# Altium project XMS0004.PrjPcb (part 3 of 3)

## Sheet Clocks.SchDoc: xcore.ai Multi Channel Audio
size 408 x 287 mm; DocumentNumber: 6; Revision: 1V1; SheetNumber: 6; SheetTotal: 8
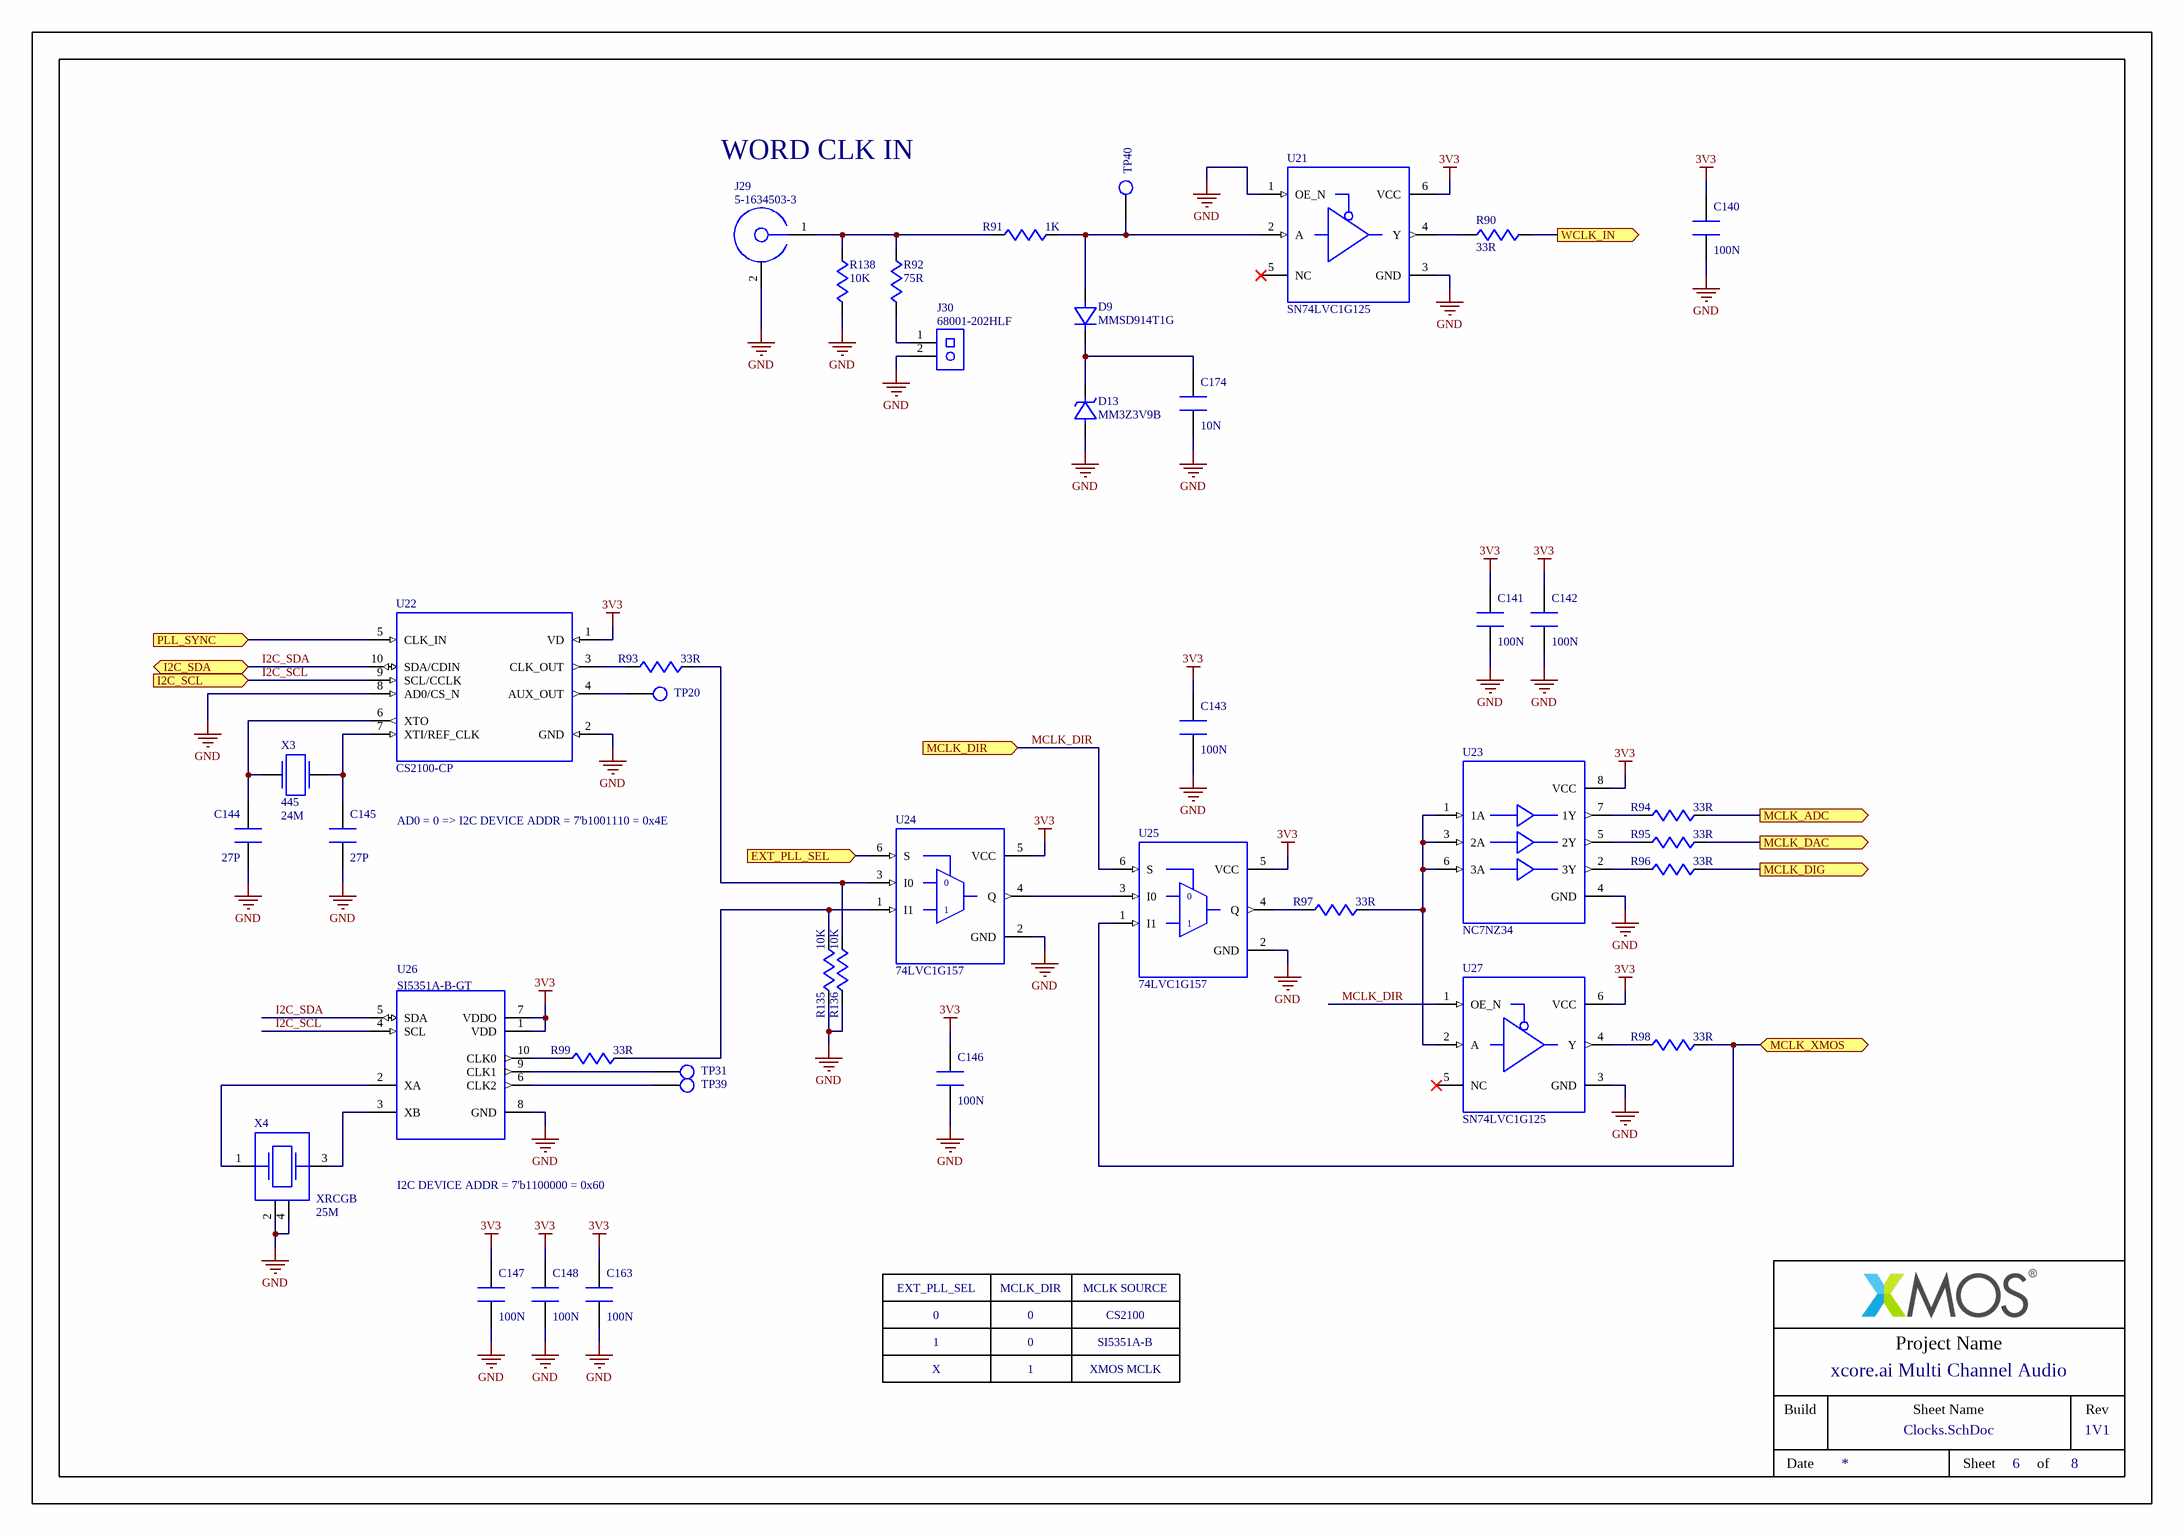
[diagram p9: Clocks.SchDoc]

### Parts
C140  100N  [CAPC1005X55N]
C141  100N  [CAPC1005X55N]
C142  100N  [CAPC1005X55N]
C143  100N  [CAPC1005X55N]
C144  27P  [CAPC1005X55N]
C145  27P  [CAPC1005X55N]
C146  100N  [CAPC1005X55N]
C147  100N  [CAPC1005X55N]
C148  100N  [CAPC1005X55N]
C163  100N  [CAPC1005X55N]
C174  10N  [CAPC1005X55N]
D9  MMSD914T1G  [SOD3716X135N]
D13  MM3Z3V9B  [SODFL2513X100N]
J29  5-1634503-3  [CON_TE_5_1634503]
J30  68001-202HLF  [HDR_FCI_68001_202]
R90  33R  [RESC1608X55N]
R91  1K  [RESC1608X55N]
R92  75R  [RESC3116X65N]
R93  33R  [RESC1608X55N]
R94  33R  [RESC1608X55N]
R95  33R  [RESC1608X55N]
R96  33R  [RESC1608X55N]
R97  33R  [RESC1608X55N]
R98  33R  [RESC1608X55N]
R99  33R  [RESC1608X55N]
R135  10K  [RESC1608X55N]
R136  10K  [RESC1608X55N]
R138  10K  [RESC1608X55N]
TP20  TESTPOINT  [TESTPOINT_THRU]  (value not drawn)  (no BOM)
TP31  TESTPOINT  [TESTPOINT_THRU]  (value not drawn)  (no BOM)
TP39  TESTPOINT  [TESTPOINT_THRU]  (value not drawn)  (no BOM)
TP40  TESTPOINT  [TESTPOINT_SMD_1MM]  (value not drawn)  (no BOM)
U21  SN74LVC1G125  [TI_R_PUSON_N6]
U22  CS2100-CP  [SOP50P490X110-10N]
U23  NC7NZ34  [SOP50P310X100-8N]
U24  74LVC1G157  [SOT95P280X145-6N]
U25  74LVC1G157  [SOT95P280X145-6N]
U26  SI5351A-B-GT  [SOP50P490X110-10N]
U27  SN74LVC1G125  [TI_R_PUSON_N6]
X3  445  FREQUENCY: 24M  [XTAL_CTS_445]
X4  XRCGB  FREQUENCY: 25M  [OSCCC200X160X70N]

### Ports
EXT_PLL_SEL (in), I2C_SCL (in), I2C_SDA (bidir), MCLK_ADC (out), MCLK_DAC (out), MCLK_DIG (out), MCLK_DIR (in), MCLK_XMOS (bidir), PLL_SYNC (in), WCLK_IN (out)

### Nets
3V3: C140.1 C141.1 C142.1 C143.1 C146.1 C147.1 C148.1 C163.1 U21.6(VCC) U22.1(VD) U23.8(VCC) U24.5(VCC) U25.5(VCC) U26.1(VDD) U26.7(VDDO) U27.6(VCC)
GND: C140.2 C141.2 C142.2 C143.2 C144.2 C145.2 C146.2 C147.2 C148.2 C163.2 C174.2 D13.2(A) J29.2 J30.2 R135.1 R136.1 R138.1 U21.1(OE_N) U21.3(GND) U22.2(GND) U22.8(AD0/CS_N) U23.4(GND) U24.2(GND) U25.2(GND) U26.8(GND) U27.3(GND) X4.2(CASE_2) X4.4(CASE_4)
EXT_PLL_SEL: U24.6(S) ; port EXT_PLL_SEL
I2C_SCL: U22.9(SCL/CCLK) U26.4(SCL) ; port I2C_SCL  [project net I2C1_SCL]
I2C_SDA: U22.10(SDA/CDIN) U26.5(SDA) ; port I2C_SDA  [project net I2C1_SDA]
MCLK_ADC: R94.2 ; port MCLK_ADC
MCLK_DAC: R95.2 ; port MCLK_DAC
MCLK_DIG: R96.2 ; port MCLK_DIG
MCLK_DIR: U25.6(S) U27.1(OE_N) ; port MCLK_DIR
MCLK_XMOS: R98.2 U25.1(I1) ; port MCLK_XMOS
PLL_SYNC: U22.5(CLK_IN) ; port PLL_SYNC
WCLK_IN: R90.2 ; port WCLK_IN
NetC144_1: C144.1 U22.6(XTO) X3.1(A)
NetC145_1: C145.1 U22.7(XTI/REF_CLK) X3.2(B)
NetC174_1: C174.1 D9.1(K) D13.1(K)
NetD9_2: D9.2(A) R91.2 TP40.1 U21.2(A)
NetJ29_1: J29.1 R91.1 R92.2 R138.2
NetJ30_1: J30.1 R92.1
NetR90_1: R90.1 U21.4(Y)
NetR93_1: R93.1 U22.3(CLK_OUT)
NetR93_2: R93.2 R136.2 U24.3(I0)
NetR94_1: R94.1 U23.7(1Y)
NetR95_1: R95.1 U23.5(2Y)
NetR96_1: R96.1 U23.2(3Y)
NetR97_1: R97.1 U25.4(Q)
NetR97_2: R97.2 U23.1(1A) U23.3(2A) U23.6(3A) U27.2(A)
NetR98_1: R98.1 U27.4(Y)
NetR99_1: R99.1 U26.10(CLK0)
NetR99_2: R99.2 R135.2 U24.1(I1)
NetTP20_1: TP20.1 U22.4(AUX_OUT)
NetTP31_1: TP31.1 U26.9(CLK1)
NetTP39_1: TP39.1 U26.6(CLK2)
NetU24_4: U24.4(Q) U25.3(I0)
NetU26_2: U26.2(XA) X4.1(A)
NetU26_3: U26.3(XB) X4.3(B)

Not connected (* = marked no-connect by the designer): U21 5(NC)*; U27 5(NC)*

### Notes on the sheet
- WORD CLK IN
- AD0 = 0 => I2C DEVICE ADDR = 7'b1001110 = 0x4E
- I2C DEVICE ADDR = 7'b1100000 = 0x60
- EXT_PLL_SEL
- MCLK_DIR
- MCLK SOURCE
- 0
- 1
- SI5351A-B
- CS2100
- X
- XMOS MCLK
- Project Name
- Build
- Sheet Name
- Rev
- Date
- Sheet
- of
- (in symbol GEN-11-0050) 0

### Library data of the parts
C140-C143 C146-C148 C163 = STD-06-0048: as C1-C4 on sheet XTAG4; VALUE: 100N; Part Number: STD-06-0048; Dielectric: X7R; Rated Voltage: 16V; Tolerance: 10%; Web Search Link: http://www.google.com/search?q=CC0402KRX7R7BB104
C144 C145 = STD-06-0018: CHIP CAPACITOR, CERAMIC, 27PF, 50V, 5%, NP0, 0402; Manufacturer: Yageo; Manufacturer Part Number: CC0402JRNPO9BN270; Approx Volume Cost ($): 0.003; VALUE: 27P; Part Number: STD-06-0018; Dielectric: NP0; Rated Voltage: 50V; Tolerance: 5%; Web Search Link: http://www.google.com/search?q=CC0402JRNPO9BN270
C174 = STD-06-0042: CHIP CAPACITOR, CERAMIC, 10NF, 50V, 10%, X7R, 0402; Manufacturer: Yageo; Manufacturer Part Number: CC0402KRX7R9BB103; Approx Volume Cost ($): 0.002; VALUE: 10N; Part Number: STD-06-0042; Dielectric: X7R; Rated Voltage: 50V; Tolerance: 10%; Web Search Link: http://www.google.com/search?q=CC0402KRX7R9BB103
D9 = GEN-16-0055: Diode, 100V, 0.2A, SOD123; Manufacturer: ON Semiconductor; Approx Volume Cost ($): 0.04; VALUE: MMSD914T1G; Part Number: GEN-16-0055; Manufacturer Part Number: MMSD914T1G; Web Search Link: http://www.google.com/search?q=MMSD914T1G
D13 = GEN-16-0053: Zener Diode, 3.9V, 2%, 0.2W, SOD-323F; Manufacturer: ON Semiconductor; Approx Volume Cost ($): 0.03; VALUE: MM3Z3V9B; Part Number: GEN-16-0053; Manufacturer Part Number: MM3Z3V9B; Web Search Link: http://www.google.com/search?q=MM3Z3V9B
J29 = GEN-01-0127: BNC Jack, Board Mount, Vertical, 75 ohm, w/Mounting Posts; Manufacturer: TE Connectivity; Approx Volume Cost ($): 1.4; VALUE: 5-1634503-3; Part Number: GEN-01-0127; Manufacturer Part Number: 5-1634503-3; Web Search Link: http://www.google.com/search?q=5-1634503-3
J30 = GEN-01-0011: Pin Header, Male, Vertical, Through Hole, 2 Way, 1x2, 0.1 Inch Pitch; Manufacturer: FCI; Approx Volume Cost ($): 0.08; VALUE: 68001-202HLF; Part Number: GEN-01-0011; Manufacturer Part Number: 68001-202HLF; Web Search Link: http://www.google.com/search?q=68001-202HLF
R90 R93-R99 = STD-02-0026: CHIP RESISTOR, 33 OHM, 0.1W, 1%, 0603; Manufacturer: Yageo; Manufacturer Part Number: RC0603FR-0733RL; Max Voltage: 50V; Max Power: 100mW; Temperature Coefficient: ±100ppm/°C; Approx Volume Cost ($): 0.002; VALUE: 33R; Part Number: STD-02-0026; Tolerance: 1%; Web Search Link: http://www.google.com/search?q=RC0603FR-0733RL
R91 = STD-02-0062: CHIP RESISTOR, 1.0K OHM, 0.1W, 1%, 0603; Manufacturer: Yageo; Manufacturer Part Number: RC0603FR-071KL; Max Voltage: 50V; Max Power: 100mW; Temperature Coefficient: ±100ppm/°C; Approx Volume Cost ($): 0.002; VALUE: 1K; Part Number: STD-02-0062; Tolerance: 1%; Web Search Link: http://www.google.com/search?q=RC0603FR-071KL
R92 = STD-05-0035: CHIP RESISTOR, 75 OHM, 0.25W, 1%, 1206; Manufacturer: Yageo; Manufacturer Part Number: RC1206FR-0775RL; Max Voltage: 200V; Max Power: 250mW; Temperature Coefficient: ±100ppm/°C; Approx Volume Cost ($): 0.004; VALUE: 75R; Part Number: STD-05-0035; Tolerance: 1%; Web Search Link: http://www.google.com/search?q=RC1206FR-0775RL
R135 R136 R138 = STD-02-0086: CHIP RESISTOR, 10K OHM, 0.1W, 1%, 0603; Manufacturer: Yageo; Manufacturer Part Number: RC0603FR-0710KL; Max Voltage: 50V; Max Power: 100mW; Temperature Coefficient: ±100ppm/°C; Approx Volume Cost ($): 0.002; VALUE: 10K; Part Number: STD-02-0086; Tolerance: 1%; Web Search Link: http://www.google.com/search?q=RC0603FR-0710KL
TP20 TP31 TP39 = GEN-24-0002: Testpoint, Through Hole; Manufacturer: NA; VALUE: TESTPOINT; Part Number: GEN-24-0002; Manufacturer Part Number: NA; Approx Volume Cost ($): NA
TP40 = GEN-24-0003: Testpoint, SMD, 1mm; Manufacturer: NA; VALUE: TESTPOINT; Part Number: GEN-24-0003; Manufacturer Part Number: NA; Approx Volume Cost ($): NA
U21 U27 = GEN-11-0049: Single Buffer with 3-State Output, LVC Series, SON6; Manufacturer: Texas Instruments; Manufacturer Part Number: SN74LVC1G125DRYR; Approx Volume Cost ($): 0.14; VALUE: SN74LVC1G125; Part Number: GEN-11-0049; Web Search Link: http://www.google.com/search?q=SN74LVC1G125DRYR
U22 = GEN-07-0007: Fractional-N Clock Multiplier, I2C/SPI Control, MSOP10; Manufacturer: Cirrus Logic; Manufacturer Part Number: CS2100CP-CZZ; Approx Volume Cost ($): 3.23; VALUE: CS2100-CP; Part Number: GEN-07-0007; Web Search Link: http://www.google.com/search?q=CS2100CP-CZZ
U23 = GEN-11-0025: Triple Logic Buffer, UHS Series, US8; Manufacturer: Fairchild; Manufacturer Part Number: NC7NZ34K8X; Approx Volume Cost ($): 0.17; VALUE: NC7NZ34; Part Number: GEN-11-0025; Web Search Link: http://www.google.com/search?q=NC7NZ34K8X
U24 U25 = GEN-11-0050: Two Input Non-Inverting Multiplexer, LVC Series, TSOP6; Manufacturer: Nexperia; Manufacturer Part Number: 74LVC1G157GV; Approx Volume Cost ($): 0.1; VALUE: 74LVC1G157; Part Number: GEN-11-0050; Web Search Link: http://www.google.com/search?q=74LVC1G157GV
U26 = GEN-07-0005: Clock Generator, I2C Programmable, XTAL Input, 3 Outputs, MSOP10; Manufacturer: Silicon Labs; Approx Volume Cost ($): 1.03; VALUE: SI5351A-B-GT; Part Number: GEN-07-0005; Manufacturer Part Number: SI5351A-B-GT; Web Search Link: http://www.google.com/search?q=SI5351A-B-GT
X3 = GEN-15-0041: Crystal, 24MHz, Freq Tol. ±30ppm, Freq Stab. ±30ppm, CL 18pF, Max ESR 40 Ohm, 5x3.2mm SMD; Manufacturer: CTS; Manufacturer Part Number: 445C33D24M00000; Approx Volume Cost ($): 0.33; VALUE: 445; Part Number: GEN-15-0041; Web Search Link: http://www.google.com/search?q=445C33D24M00000
X4 = GEN-15-0039: Crystal, 25MHz, Freq Tol. ±25ppm, Freq Stab. ±40ppm, CL 8pF, Max ESR 80 Ohm, 2.0x1.6mm SMD; Manufacturer: Murata; Manufacturer Part Number: XRCGB25M000FAM10R0; Approx Volume Cost ($): 0.27; VALUE: XRCGB; Part Number: GEN-15-0039; Web Search Link: http://www.google.com/search?q=XRCGB25M000FAM10R0

## Nets that join several sheets
0V9: XMOS (30 pins), Power (5 pins)
1V8: Top Level (C164.1 J1.1 J4.1 R43.2), XMOS (6 pins), Power (C119.1 R77.2 TP22.1 U18.5), XTAG4 (C20.1 R11.2 U4.16)
3V3: Top Level (14 pins), Power (14 pins), ADC (9 pins), DAC (17 pins), DigitalIO (20 pins), Clocks (16 pins)
3V3A: Power (6 pins), ADC (6 pins), DAC (20 pins)
3V3X: Top Level (7 pins), XMOS (14 pins), Power (9 pins), XTAG4 (C19.1 U2.16)
GND: Top Level (74 pins), XMOS (34 pins), Power (52 pins), ADC (35 pins), DAC (60 pins), XTAG4 (70 pins), DigitalIO (28 pins), Clocks (28 pins)
USB_VBUS: Top Level (C64.1 J15.2 R47.2 R48.2), Power (J22.1)
ADC_D0: Top Level (J6.2 R24.2), ADC (U19.18)
ADC_D1: Top Level (J9.2 R25.2), ADC (U19.22)
ADC_D2: Top Level (J11.2 R27.2), ADC (U20.18)
ADC_D3: Top Level (J13.2 R32.2), ADC (U20.22)
ADC_GPIO: Top Level (J7.12), XMOS (U8.126), ADC (R80.1 R86.1)
BCLK: Top Level (J7.9 R13.2), ADC (U19.17 U20.17), DAC (5 pins)
BUT_0: Top Level (R23.1 SW1.1A), XMOS (U8.88)
BUT_1: Top Level (R37.1 SW2.1A), XMOS (U8.90)
BUT_2: Top Level (R119.1 SW3.1A), XMOS (U8.123)
COAX_RX: Top Level (J41.6), XMOS (U8.96), DigitalIO (R111.2)
COAX_TX: Top Level (J41.5), XMOS (U8.19), DigitalIO (U29.3)
DAC_D0: Top Level (J3.2), DAC (U10.22)
DAC_D1: Top Level (J8.2), DAC (U12.22)
DAC_D2: Top Level (J10.2), DAC (U11.22)
DAC_D3: Top Level (J12.2), DAC (U13.22)
DAC_MUTE_N: Top Level (J7.10), XMOS (U8.9), DAC (5 pins)
EXT_PLL_SEL: Top Level (J43.8), XMOS (U8.100), Clocks (U24.6)
I2C0_SCL: Top Level (5 pins), ADC (U19.24 U20.24), DAC (U10.12 U11.12 U12.12 U13.12)
I2C0_SDA: Top Level (5 pins), ADC (U19.23 U20.23), DAC (U10.11 U11.11 U12.11 U13.11)
I2C1_SCL: Top Level (R129.1 R133.1 U33.8), Clocks (U22.9 U26.4)
I2C1_SDA: Top Level (R130.1 R134.1 U33.7), Clocks (U22.10 U26.5)
I2C_SCL: Top Level (R41.1 R131.2 U33.1), XMOS (U8.93)
I2C_SDA: Top Level (R42.1 R132.2 U33.2), XMOS (U8.94)
I2S_DAC_LOOP_D0: Top Level (R24.1), DAC (U10.19)
I2S_DAC_LOOP_D1: Top Level (R25.1), DAC (U12.19)
I2S_DAC_LOOP_D2: Top Level (R27.1), DAC (U11.19)
I2S_DAC_LOOP_D3: Top Level (R32.1), DAC (U13.19)
LED_0: Top Level (R36.2), XMOS (U8.91)
LED_1: Top Level (R35.2), XMOS (U8.92)
LED_2: Top Level (R34.2), XMOS (U8.122)
LED_3: Top Level (R33.2), XMOS (U8.124)
LRCK: Top Level (J7.11 R12.2), ADC (U19.16 U20.16), DAC (5 pins)
MCLK_ADC: ADC (U19.15 U20.15), Clocks (R94.2)
MCLK_DAC: Top Level (J7.1), DAC (5 pins), Clocks (R95.2)
MCLK_DIG: Top Level (J41.7), DigitalIO (U29.1 U31.1), Clocks (R96.2)
MCLK_DIR: Top Level (J43.6), XMOS (U8.103), Clocks (U25.6 U27.1)
MCLK_X_PIN: Top Level (R117.1 R118.1 TP27.1), XMOS (U8.23)
MCLK_XMOS: Top Level (R117.2), Clocks (R98.2 U25.1)
MIDI_RX: Top Level (J41.10), XMOS (U8.64), DigitalIO (R120.2)
MIDI_TX: Top Level (J41.9), XMOS (U8.63), DigitalIO (R106.1 U32.1)
NetR12_1: Top Level (R12.1), XMOS (U8.20)
NetR13_1: Top Level (R13.1), XMOS (U8.22)
NetR39_1: Top Level (R39.1), XMOS (U8.69)
NetR40_1: Top Level (R40.1), XMOS (U8.70)
NetR118_2: Top Level (R118.2), XMOS (U8.7)
NetR122_2: Top Level (R122.2), XMOS (U8.37)
OPT_RX: Top Level (J41.4), XMOS (U8.97), DigitalIO (R116.2)
OPT_TX: Top Level (J41.3), XMOS (U8.74), DigitalIO (U31.3)
PLL_SYNC: Top Level (J43.2), XMOS (U8.6), Clocks (U22.5)
QSPI_CLK: Top Level (J44.7 U9.6), XMOS (U8.4)
QSPI_CS_N: Top Level (J44.9 R38.1 U9.1), XMOS (U8.2)
QSPI_D0: Top Level (J44.3 U9.5), XMOS (U8.127)
QSPI_D1: Top Level (J44.4 U9.2), XMOS (U8.128)
QSPI_D2: Top Level (J44.5 U9.3), XMOS (U8.1)
QSPI_D3: Top Level (J44.6 U9.7), XMOS (U8.3)
RST_N: Top Level (C177.1 J4.10 J45.10 R43.1), XMOS (U8.38), XTAG4 (U5.4)
SUSPEND_N: Top Level (J43.5), XMOS (U8.101), Power (R64.2 U34.3 U35.3)
TCK: Top Level (J4.4 J45.4), XMOS (U8.51), XTAG4 (R14.7)
TDI: Top Level (J4.8), XMOS (U8.36), XTAG4 (R14.5)
TDO: Top Level (J4.6 R123.2 R124.1), XTAG4 (R11.1 R14.6)
TMS: Top Level (J4.2 J45.2), XMOS (U8.44), XTAG4 (R14.8)
USB_D_N: Top Level (D8.6 J16.2), XMOS (U8.59)
USB_D_P: Top Level (D8.1 J16.3), XMOS (U8.60)
VBUS_DETECT: Top Level (J43.3 Q1.3 R44.1), XMOS (U8.8)
WCLK_IN: Top Level (J43.10), XMOS (U8.99), Clocks (R90.2)
X0D12: Top Level (J1.3), XMOS (U8.46)
X0D13: Top Level (J1.4), XMOS (U8.47)
X0D22: Top Level (J1.5), XMOS (U8.48), Power (R75.1)
X0D23: Top Level (J1.6), XMOS (U8.49)
X0D24: Top Level (J37.9), XMOS (U8.86)
X0D25: Top Level (J37.10), XMOS (U8.87)
X0D34: Top Level (J43.1), XMOS (U8.125)
X0D40: Top Level (J43.9), XMOS (U8.98)
X1D09: Top Level (TP32.1), XMOS (U8.21)
X1D12: Top Level (J1.7), XMOS (U8.53)
X1D15: Top Level (J37.3), XMOS (U8.65)
X1D20: Top Level (J37.4), XMOS (U8.71)
X1D21: Top Level (J37.5), XMOS (U8.73)
X1D23: Top Level (J1.9), XMOS (U8.57)
X1D26: Top Level (J42.1), XMOS (U8.110)
X1D27: Top Level (J42.2), XMOS (U8.111)
X1D28: Top Level (J42.3), XMOS (U8.112)
X1D29: Top Level (J42.5), XMOS (U8.114)
X1D30: Top Level (J42.6), XMOS (U8.115)
X1D31: Top Level (J42.8), XMOS (U8.116)
X1D32: Top Level (J42.9), XMOS (U8.117)
X1D33: Top Level (J42.10), XMOS (U8.118)
X1D43: Top Level (J37.6), XMOS (U8.102)
X1D49: Top Level (J38.2), XMOS (U8.75)
X1D50: Top Level (J38.3), XMOS (U8.76)
X1D51: Top Level (J38.5), XMOS (U8.77)
X1D52: Top Level (J38.6), XMOS (U8.78)
X1D53: Top Level (J38.7), XMOS (U8.79)
X1D54: Top Level (J38.10), XMOS (U8.80)
X1D55: Top Level (J38.11), XMOS (U8.81)
X1D56: Top Level (J38.12), XMOS (U8.82)
X1D57: Top Level (J38.14), XMOS (U8.83)
X1D58: Top Level (J38.15), XMOS (U8.84)
X_ADC_D0: Top Level (J6.3 J7.19), XMOS (U8.107)
X_ADC_D1: Top Level (J7.18 J9.3), XMOS (U8.108)
X_ADC_D2: Top Level (J7.17 J11.3), XMOS (U8.119)
X_ADC_D3: Top Level (J7.16 J13.3), XMOS (U8.120)
X_DAC_D0: Top Level (J3.3 J7.3), XMOS (U8.16)
X_DAC_D1: Top Level (J7.4 J8.3), XMOS (U8.15)
X_DAC_D2: Top Level (J7.5 J10.3), XMOS (U8.13)
X_DAC_D3: Top Level (J7.6 J12.3), XMOS (U8.12)
XL_DN0: Top Level (J4.14), XMOS (U8.67), XTAG4 (R3.7)
XL_DN1: Top Level (J4.12), XMOS (U8.66), XTAG4 (R3.8)
XL_UP0: Top Level (J4.16 R39.2), XTAG4 (R3.6 R5.2)
XL_UP1: Top Level (J4.18 R40.2), XTAG4 (R3.5 R4.2)

## Assembly variants
A: not fitted F2 FB4 FB4 J1 J4 J7 J15 J24 J37 J38 J41 J42 J43 J44 J45 R26 R65 R124 R131 R132 R133 R134 R137 R137 R141
B: alternate parts U9 -> GEN-12-0031